# Altium schematic sheet ACR_2_Sheet7.SchDoc
size 209 x 297 mm; PageSetup: Record=PageOptions|CenterHorizontal=True|CenterVertical=True|PrintScale=0.94|XCorrection=1.00|YCorrection=1.00|PrintKind=1|BorderSize=5000000|LeftOffset=0|BottomOffset=0|Orientation=1|PaperLength=1000|PaperWidth=1000|Scale=100|PaperSource=7|PrintQuality=-4|MediaType=1|DitherType=10|PrintScaleMode=1|PaperKind=A4; DecimalNumber: Децимальный номер; HeadOfSector: Нач. сектора; MainDevice: Перв.примен.; Name: Наименование
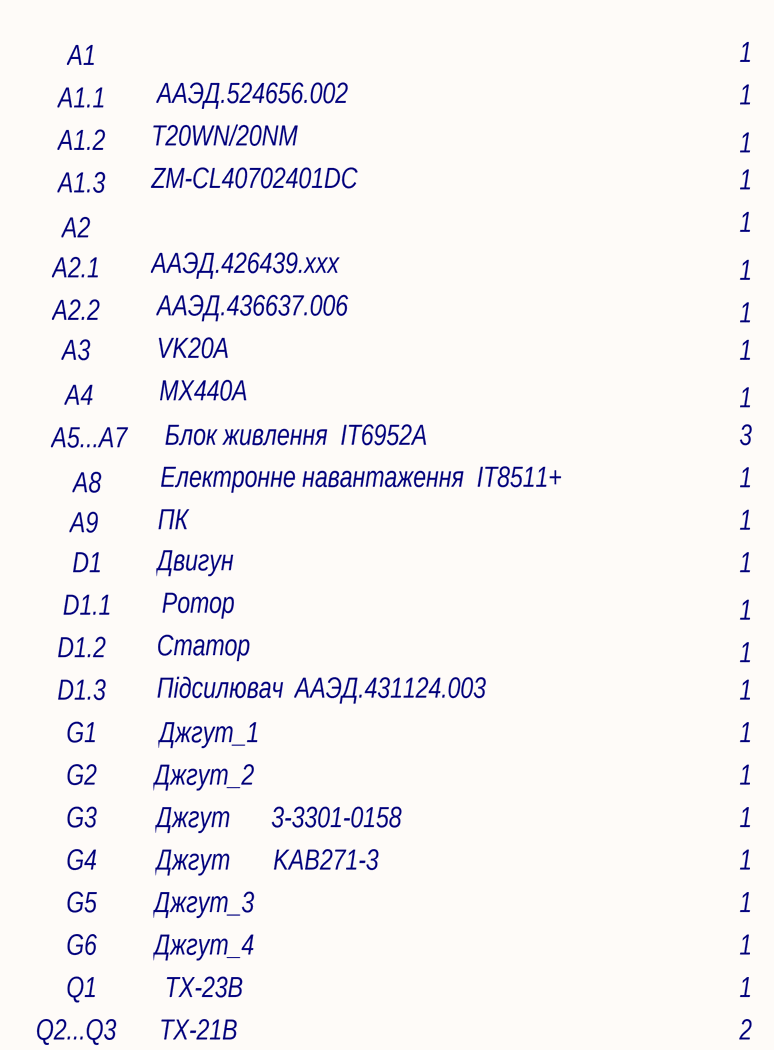
[diagram p0: ACR_2_Sheet7.SchDoc]

## Notes on the sheet
- А1
- А1.1
- ААЭД.524656.002
- 1
- А1.2
- А1.3
- T20WN/20NM
- А2
- ZM-CL40702401DC
- А2.1
- А2.2
- ААЭД.426439.ххх
- А3
- ААЭД.436637.006
- VK20A
- А4
- А5...A7
- MX440A
- Блок живлення  IT6952A
- 3
- A9
- A8
- ПК
- Електронне навантаження  IT8511+
- D1
- Двигун
- D1.2
- D1.1
- Ротор
- D1.3
- Статор
- Підсилювач
- ААЭД.431124.003
- G1
- G2
- Джгут_2
- Джгут_1
- G3
- G4
- Джгут
- KAB271-3
- 3-3301-0158
- G5
- Джгут_3
- Q1
- G6
- ТХ-23В
- Джгут_4
- Q2...Q3
- ТХ-21В
- 2
- Поз.
- обозна-
- чение
- Наименование
- Кол.
- Примечание
- Перв.примен.
- Справ.№
- Подп. и дата
- Инв.№ дубл.
- Взам.инв.№
- Подп.и дата
- Изм.
- Лист
- № докум.
- Подп.
- Дата
- Разраб.
- Пров.
- Лит.
- Листов
- Инв.№ подл.
- Утв.
- Н.контр.
- ПЕРЕЛІК ЕЛЕМЕНТІВ
- Копировал
- Формат  A4